# Altium schematic sheet PG03 SHEET1.schdoc
size B; Date: 1/11/2012; ApprovedBy: Touraj; DrawnBy: Touraj Ghaffari; Engineer: Touraj; Organization: ActiveWave; Address1: 902 Clint Moore Rd., Suite 126; Address2: Boca Raton; Address3: FL, 33487; Address4: 561-999-9422; DocumentNumber: 3; Revision: 20; SheetNumber: 3; SheetTotal: 4; PageSetup: Record=PageOptions|CenterHorizontal=True|CenterVertical=True|PrintScale=0.70|XCorrection=1.00|YCorrection=1.00|PrintKind=0|BorderSize=5000000|LeftOffset=0|BottomOffset=0|Orientation=2|PaperLength=1000|PaperWidth=1000|Scale=100|PaperSource=7|PrintQuality=-4|MediaType=1|DitherType=10|PaperKind=Letter|PrintScaleMode=1; Project: Tag102
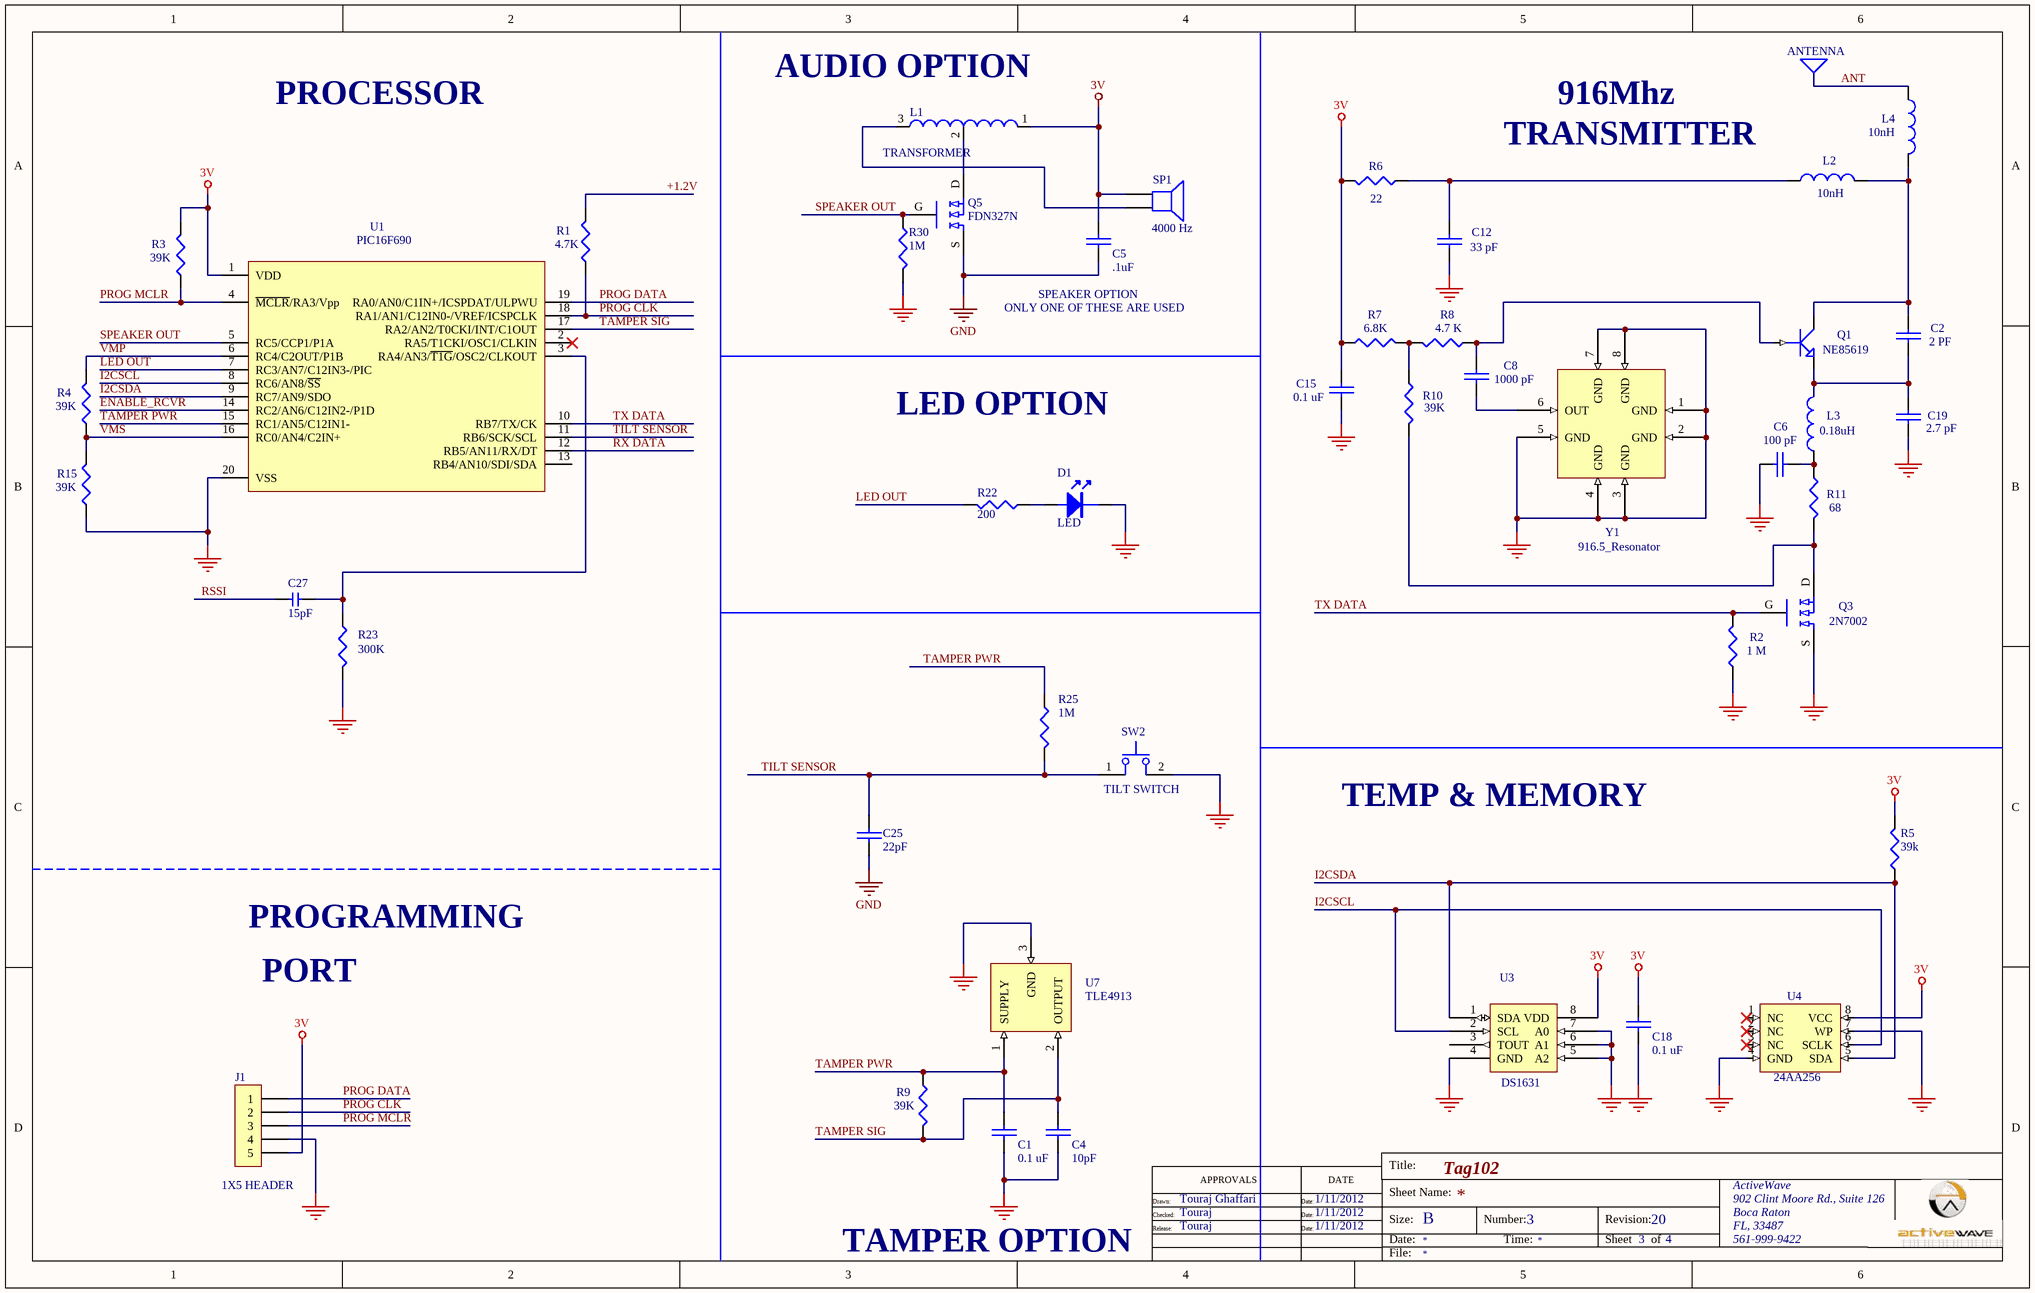
[diagram p0: PG03 SHEET1.schdoc]

## Parts
C1  0.1 uF  [0603]
C2  2 PF  [0603]
C4  10pF  [0603]
C5  .1uF  [0603]
C6  100 pF  [0603]
C8  1000 pF  [0603]
C12  33 pF  [0603]
C15  0.1 uF  [0603]
C18  0.1 uF  [0603]
C19  2.7 pF  [0603]
C25  22pF  [0603]
C27  15pF  [0603]
D1  LED  [LED STANLEY H_1105W]
J1  1X5 HEADER  [1X5 HEADER]
L1  TRANSFORMER  [COIL_6mmx6mm_011012]
L2  10nH  [0603]
L3  0.18uH  [0603]
L4  10nH  [0603]
Q1  NE85619  [3 PIN ULTRA SUPER MINI MOLD]
Q3  2N7002
Q5  FDN327N  [SOT23 FET]
R1  4.7K  [0603]
R2  1 M  [0603]
R3  39K  [0603]
R4  39K  [0603]
R5  39k  [0603]
R6  22  [0603]
R7  6.8K  [0603]
R8  4.7 K  [0603]
R9  39K  [0603]
R10  39K  [0603]
R11  68  [0603]
R15  39K  [0603]
R22  200  [0603]
R23  300K  [0603]
R25  1M  [0603]
R30  1M  [0603]
SP1  4000 Hz  [SPEAKER 12mmx12mm_011012]
SW2  TILT SWITCH  [SQ-SEN-DUAL1]
U1  PIC16F690
U3  DS1631  [SO8 SMALL]
U4  24AA256  [SO8]
U7  TLE4913  [SOT23W]
Y1  916.5_Resonator  [RESONATOR]

## Nets
3V: C5.1 C15.1 C18.1 J1.5 L1.1 R3.2 R5.2 R6.2 R7.1 SP1.1 U1.1(VDD) U3.8(VDD) U4.8(VCC)
GND: C1.2 C4.2 C5.2 C6.1 C12.2 C15.2 C18.2 C19.2 C25.2 D1.K J1.4 Q3.S Q5.S R2.1 R15.1 R23.2 R30.2 SW2.2 U1.20(VSS) U3.4(GND) U3.5(A2) U3.6(A1) U3.7(A0) U4.4(GND) U4.7(WP) U7.3(GND) Y1.1(GND) Y1.2(GND) Y1.3(GND) Y1.4(GND) Y1.5(GND) Y1.7(GND) Y1.8(GND)
+1.2V: R1.2
ANT: L4.1
ENABLE_RCVR: U1.14(RC2/AN6/C12IN2-/P1D)
I2CSCL: U1.8(RC6/AN8/~{SS}) U3.2(SCL) U4.6(SCLK)
I2CSDA: R5.1 U1.9(RC7/AN9/SDO) U3.1(SDA) U4.5(SDA)
LED OUT: R22.2 U1.7(RC3/AN7/C12IN3-/PIC)
PROG CLK: J1.2 R1.1 U1.18(RA1/AN1/C12IN0-/VREF/ICSPCLK)
PROG DATA: J1.1 U1.19(RA0/AN0/C1IN+/ICSPDAT/ULPWU)
PROG MCLR: J1.3 R3.1 U1.4(~{MCLR}/RA3/Vpp)
RSSI: C27.2
RX DATA: U1.12(RB5/AN11/RX/DT)
SPEAKER OUT: Q5.G R30.1 U1.5(RC5/CCP1/P1A)
TAMPER PWR: C1.1 R9.1 R25.1 U1.15(RC1/AN5/C12IN1-) U7.1(SUPPLY)
TAMPER SIG: C4.1 R9.2 U1.17(RA2/AN2/T0CKI/INT/C1OUT) U7.2(OUTPUT)
TILT SENSOR: C25.1 R25.2 SW2.1 U1.11(RB6/SCK/SCL)
TX DATA: Q3.G R2.2 U1.10(RB7/TX/CK)
VMP: R4.2 U1.6(RC4/C2OUT/P1B)
VMS: R4.1 R15.2 U1.16(RC0/AN4/C2IN+)
NetC2_1: C2.1 L2.2 L4.2 Q1.C
NetC2_2: C2.2 C19.1 L3.2 Q1.E
NetC6_2: C6.2 L3.1 R11.1
NetC8_1: C8.1 Q1.B R8.1
NetC8_2: C8.2 Y1.6(OUT)
NetC12_1: C12.1 L2.1 R6.1
NetC27_1: C27.1 R23.1 U1.3(RA4/AN3/~{T1G}/OSC2/CLKOUT)
NetD1_A: D1.A R22.1
NetL1_2: L1.2 Q5.D
NetL1_3: L1.3 SP1.2
NetQ3_D: Q3.D R10.2 R11.2
NetR7_2: R7.2 R8.2 R10.1

Not connected (* = marked no-connect by the designer): U1 2(RA5/T1CKI/OSC1/CLKIN)* 13(RB4/AN10/SDI/SDA); U3 3(TOUT); U4 1(NC)* 2(NC)* 3(NC)*

## Notes on the sheet
- (near L1) AUDIO OPTION
- ANTENNA
- PROCESSOR
- TRANSMITTER
- 916Mhz
- (near C5) SPEAKER OPTION
- ONLY ONE OF THESE ARE USED
- LED OPTION
- TEMP & MEMORY
- PROGRAMMING
- PORT
- TAMPER OPTION
- APPROVALS
- DATE
- Title:
- Drawn:
- Checked:
- Release:
- Date:
- Size:
- Sheet Name:
- B
- Number:
- Time:
- Revision:
- Sheet
- of
- File:

## Library data of the parts
C1 C2 C4 C6 C8 C12 C15 C18 C19 C25 = CAP: Capacitor
C5 = CAP-0603: Capacitor; ACTIVEWAVE-P/N: *; ITEM-DESCRIPTION: *; MANUFACTURER: *; MFGR-P/N: *; VALUE: .1uF
C27 = C: Text Field1: 10; Text Field2: 20
J1 = CON5: Connector
L1 = INDUCTOR_V2: VALUE: TRANSFORMER
L2-L4 = INDUCTOR: Text Field1: 20; Text Field2: 40
Q1 = NPN1: NPN Transistor
Q3 = FET 2
Q5 = FDN327N: 20V N-Channel MOSFET; MANUFACTURER: FAIRCHILD; ITEM-DESCRIPTION: N-CHANNEL 1.8 VGS SPECIFIED POWERTRENCH MOSFET; ACTIVEWAVE-P/N: *; MFGR-P/N: FDN327N; VALUE: FDN327N
R1-R10 R15 R23 R25 = RESISTOR: Text Field1: 20; Text Field2: 30
R11 R22 = RES1
R30 = RES-0402: ACTIVEWAVE-P/N: *; MFGR-P/N: *; MANUFACTURER: *; ITEM-DESCRIPTION: *; VALUE: 1M
SP1 = SMT-1028-S-R: Surface Mount Transducer; MANUFACTURER: PUI Audio; ITEM-DESCRIPTION: Audio Indicators & Alerts EM 98dB 2830H 3.6Vpp; ACTIVEWAVE-P/N: *; MFGR-P/N: CMT-1203; VALUE: 4000 Hz
SW2 = SWITCH PB
U3 = DS1631: Text Field1: 50; Text Field2: 50
U7 = HALL EFFECT SWITCH
Y1 = RESONATOR